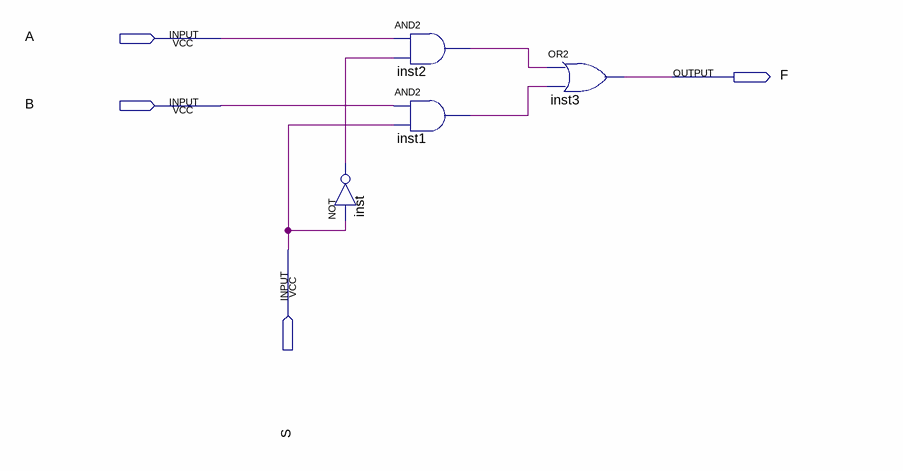
[diagram p0: schematic sheet]
// Quartus schematic mux_2x1.bdf as structural Verilog: 4 symbols, 4 pins
module mux_2x1 (
  input  A,
  input  B,
  input  S,
  output F
);

  wire inst1_out, inst2_out, inst_out;

  not inst (inst_out, S);
  and inst2 (inst2_out, A, inst_out);
  and inst1 (inst1_out, B, S);
  or inst3 (F, inst2_out, inst1_out);
endmodule
